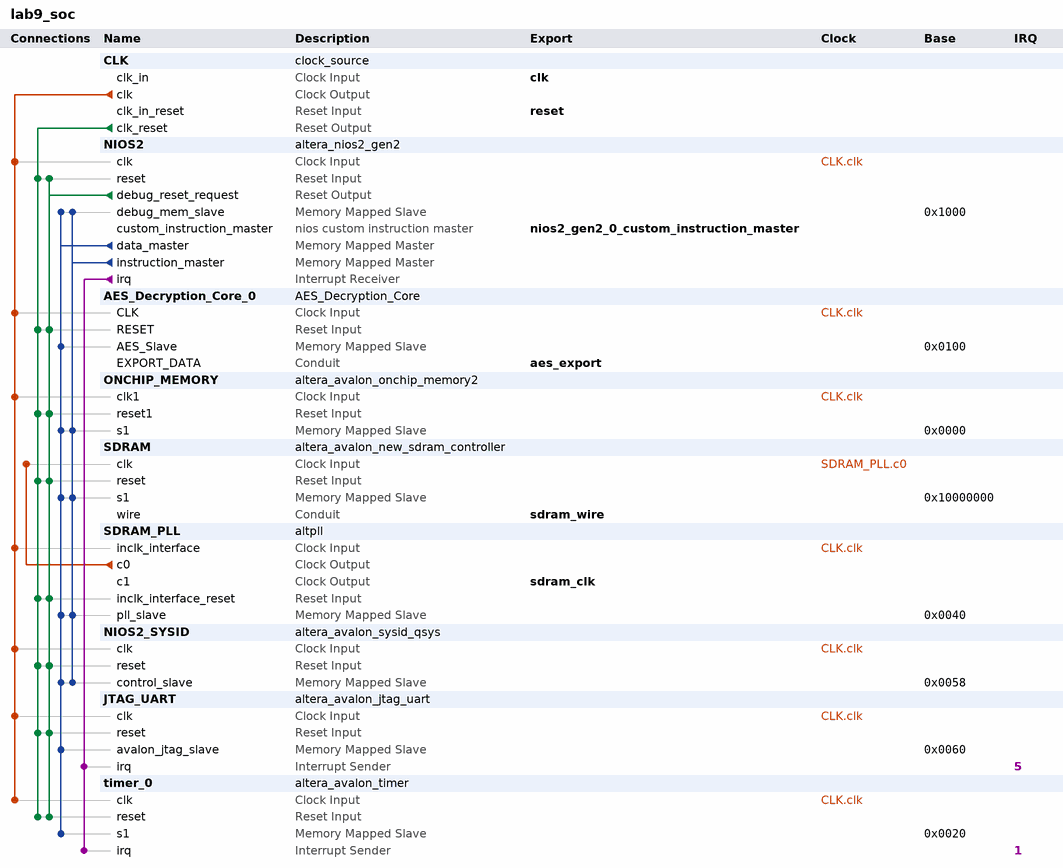
[diagram p0: system contents]
# Platform Designer (Qsys) system lab9_soc, Cyclone IV E EP4CE115F29C7
# Parameters at their usual value, and those the tool derives, are not listed.
package require -exact qsys 18.0
create_system lab9_soc
set_project_property DEVICE_FAMILY {Cyclone IV E}
set_project_property DEVICE EP4CE115F29C7

add_instance CLK clock_source 18.0
set_instance_parameter_value CLK clockFrequency 50000000

add_instance NIOS2 altera_nios2_gen2 18.0
set_instance_parameter_value NIOS2 dcache_size 2048
set_instance_parameter_value NIOS2 exceptionSlave SDRAM.s1
set_instance_parameter_value NIOS2 icache_size 4096
set_instance_parameter_value NIOS2 impl Tiny
set_instance_parameter_value NIOS2 resetSlave SDRAM.s1

add_instance AES_Decryption_Core_0 AES_Decryption_Core 2.4

add_instance ONCHIP_MEMORY altera_avalon_onchip_memory2 18.0
set_instance_parameter_value ONCHIP_MEMORY dataWidth 32
set_instance_parameter_value ONCHIP_MEMORY dualPort false
set_instance_parameter_value ONCHIP_MEMORY initMemContent true
set_instance_parameter_value ONCHIP_MEMORY initializationFileName onchip_mem.hex
set_instance_parameter_value ONCHIP_MEMORY memorySize 16

add_instance SDRAM altera_avalon_new_sdram_controller 18.0
set_instance_parameter_value SDRAM TAC 5.5
set_instance_parameter_value SDRAM TRCD 20.0
set_instance_parameter_value SDRAM TRP 20.0
set_instance_parameter_value SDRAM casLatency 3
set_instance_parameter_value SDRAM columnWidth 10
set_instance_parameter_value SDRAM dataWidth 32
set_instance_parameter_value SDRAM generateSimulationModel false
set_instance_parameter_value SDRAM model single_Micron_MT48LC4M32B2_7_chip
set_instance_parameter_value SDRAM numberOfBanks 4
set_instance_parameter_value SDRAM numberOfChipSelects 1
set_instance_parameter_value SDRAM powerUpDelay 200.0
set_instance_parameter_value SDRAM refreshPeriod 7.8125
set_instance_parameter_value SDRAM rowWidth 13

add_instance SDRAM_PLL altpll 18.0
set_instance_parameter_value SDRAM_PLL CLK0_DIVIDE_BY 1
set_instance_parameter_value SDRAM_PLL CLK0_MULTIPLY_BY 1
set_instance_parameter_value SDRAM_PLL CLK1_DIVIDE_BY 1
set_instance_parameter_value SDRAM_PLL CLK1_DUTY_CYCLE 50
set_instance_parameter_value SDRAM_PLL CLK1_MULTIPLY_BY 1
set_instance_parameter_value SDRAM_PLL CLK1_PHASE_SHIFT -3000
set_instance_parameter_value SDRAM_PLL INCLK0_INPUT_FREQUENCY 20000
set_instance_parameter_value SDRAM_PLL PORT_ARESET PORT_UNUSED
set_instance_parameter_value SDRAM_PLL PORT_LOCKED PORT_UNUSED
set_instance_parameter_value SDRAM_PLL PORT_clk1 PORT_USED
set_instance_parameter_value SDRAM_PLL PORT_clk2 PORT_UNUSED
set_instance_parameter_value SDRAM_PLL PORT_clk3 PORT_UNUSED

add_instance NIOS2_SYSID altera_avalon_sysid_qsys 18.0
set_instance_parameter_value NIOS2_SYSID id 0

add_instance JTAG_UART altera_avalon_jtag_uart 18.0
set_instance_parameter_value JTAG_UART simInteractiveOptions NO_INTERACTIVE_WINDOWS

add_instance timer_0 altera_avalon_timer 18.0
set_instance_parameter_value timer_0 period 1
set_instance_parameter_value timer_0 periodUnits MSEC

# connections
add_connection CLK.clk AES_Decryption_Core_0.CLK clock
add_connection CLK.clk JTAG_UART.clk clock
add_connection CLK.clk NIOS2.clk clock
add_connection CLK.clk NIOS2_SYSID.clk clock
add_connection CLK.clk ONCHIP_MEMORY.clk1 clock
add_connection CLK.clk SDRAM_PLL.inclk_interface clock
add_connection CLK.clk timer_0.clk clock
add_connection SDRAM_PLL.c0 SDRAM.clk clock
add_connection CLK.clk_reset AES_Decryption_Core_0.RESET reset
add_connection CLK.clk_reset JTAG_UART.reset reset
add_connection CLK.clk_reset NIOS2.reset reset
add_connection CLK.clk_reset NIOS2_SYSID.reset reset
add_connection CLK.clk_reset ONCHIP_MEMORY.reset1 reset
add_connection CLK.clk_reset SDRAM.reset reset
add_connection CLK.clk_reset SDRAM_PLL.inclk_interface_reset reset
add_connection CLK.clk_reset timer_0.reset reset
add_connection NIOS2.debug_reset_request AES_Decryption_Core_0.RESET reset
add_connection NIOS2.debug_reset_request JTAG_UART.reset reset
add_connection NIOS2.debug_reset_request NIOS2.reset reset
add_connection NIOS2.debug_reset_request NIOS2_SYSID.reset reset
add_connection NIOS2.debug_reset_request ONCHIP_MEMORY.reset1 reset
add_connection NIOS2.debug_reset_request SDRAM.reset reset
add_connection NIOS2.debug_reset_request SDRAM_PLL.inclk_interface_reset reset
add_connection NIOS2.debug_reset_request timer_0.reset reset
add_connection NIOS2.data_master AES_Decryption_Core_0.AES_Slave avalon
set_connection_parameter_value NIOS2.data_master/AES_Decryption_Core_0.AES_Slave baseAddress 0x0100
add_connection NIOS2.data_master JTAG_UART.avalon_jtag_slave avalon
set_connection_parameter_value NIOS2.data_master/JTAG_UART.avalon_jtag_slave baseAddress 0x0060
add_connection NIOS2.data_master NIOS2.debug_mem_slave avalon
set_connection_parameter_value NIOS2.data_master/NIOS2.debug_mem_slave baseAddress 0x1000
add_connection NIOS2.data_master NIOS2_SYSID.control_slave avalon
set_connection_parameter_value NIOS2.data_master/NIOS2_SYSID.control_slave baseAddress 0x0058
add_connection NIOS2.data_master ONCHIP_MEMORY.s1 avalon
set_connection_parameter_value NIOS2.data_master/ONCHIP_MEMORY.s1 baseAddress 0x0000
add_connection NIOS2.data_master SDRAM.s1 avalon
set_connection_parameter_value NIOS2.data_master/SDRAM.s1 baseAddress 0x10000000
add_connection NIOS2.data_master SDRAM_PLL.pll_slave avalon
set_connection_parameter_value NIOS2.data_master/SDRAM_PLL.pll_slave baseAddress 0x0040
add_connection NIOS2.data_master timer_0.s1 avalon
set_connection_parameter_value NIOS2.data_master/timer_0.s1 baseAddress 0x0020
add_connection NIOS2.instruction_master NIOS2.debug_mem_slave avalon
set_connection_parameter_value NIOS2.instruction_master/NIOS2.debug_mem_slave baseAddress 0x1000
add_connection NIOS2.instruction_master NIOS2_SYSID.control_slave avalon
set_connection_parameter_value NIOS2.instruction_master/NIOS2_SYSID.control_slave baseAddress 0x0058
add_connection NIOS2.instruction_master ONCHIP_MEMORY.s1 avalon
set_connection_parameter_value NIOS2.instruction_master/ONCHIP_MEMORY.s1 baseAddress 0x0000
add_connection NIOS2.instruction_master SDRAM.s1 avalon
set_connection_parameter_value NIOS2.instruction_master/SDRAM.s1 baseAddress 0x10000000
add_connection NIOS2.instruction_master SDRAM_PLL.pll_slave avalon
set_connection_parameter_value NIOS2.instruction_master/SDRAM_PLL.pll_slave baseAddress 0x0040
add_connection NIOS2.irq JTAG_UART.irq interrupt
set_connection_parameter_value NIOS2.irq/JTAG_UART.irq irqNumber 5
add_connection NIOS2.irq timer_0.irq interrupt
set_connection_parameter_value NIOS2.irq/timer_0.irq irqNumber 1

# exported interfaces
add_interface aes_export conduit end
set_interface_property aes_export EXPORT_OF AES_Decryption_Core_0.EXPORT_DATA
add_interface clk clock sink
set_interface_property clk EXPORT_OF CLK.clk_in
add_interface nios2_gen2_0_custom_instruction_master nios_custom_instruction start
set_interface_property nios2_gen2_0_custom_instruction_master EXPORT_OF NIOS2.custom_instruction_master
add_interface reset reset sink
set_interface_property reset EXPORT_OF CLK.clk_in_reset
add_interface sdram_clk clock source
set_interface_property sdram_clk EXPORT_OF SDRAM_PLL.c1
add_interface sdram_wire conduit end
set_interface_property sdram_wire EXPORT_OF SDRAM.wire

set_interconnect_requirement {$system} qsys_mm.clockCrossingAdapter HANDSHAKE
set_interconnect_requirement {$system} qsys_mm.enableEccProtection FALSE
set_interconnect_requirement {$system} qsys_mm.insertDefaultSlave FALSE
set_interconnect_requirement {$system} qsys_mm.maxAdditionalLatency 1

save_system lab9_soc.qsys
